# Altium schematic sheet HUB75B.SchDoc
size C

## Notes on the sheet
- CONFIDENTAL. Do not distribute.
- Page Contents:
- Title:
- Company
- Logo
- Date:
- SIZE:
- C
- DWG Num:
- Time:
- Variant:
- Sheet
- Revision:
- of
- Drawn by:
- Checked by: